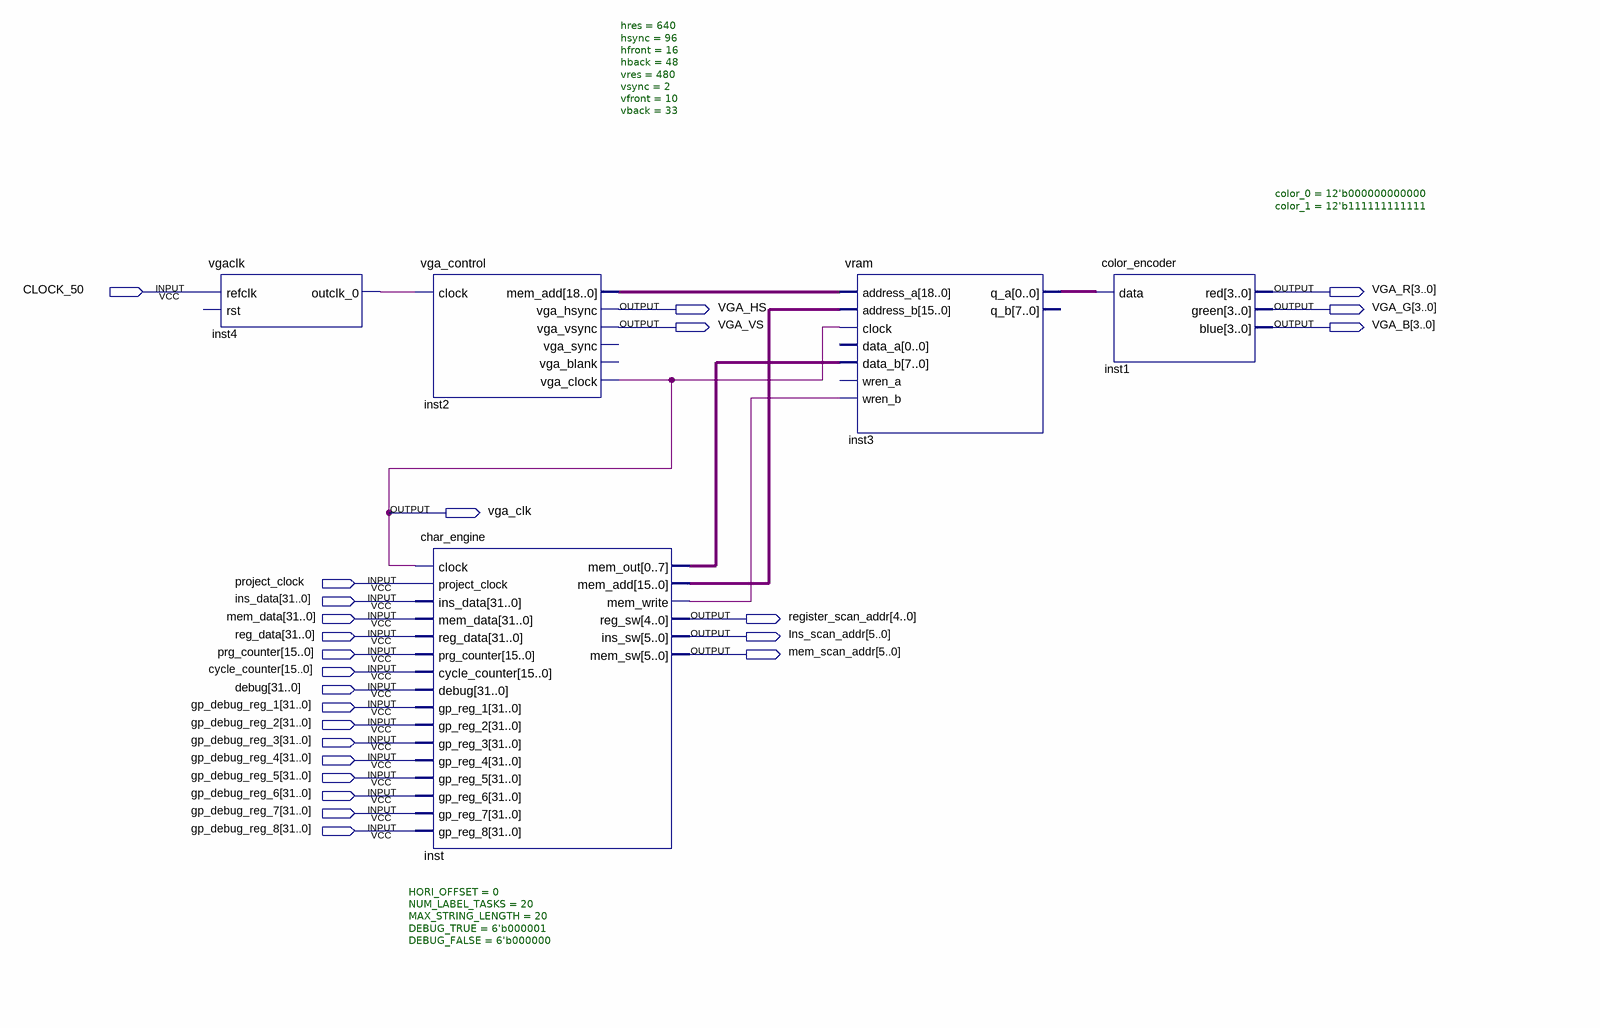
[diagram p0: schematic sheet]
// Quartus schematic VGA_BLOCK.bdf as structural Verilog: 5 symbols, 25 pins
module VGA_BLOCK (
  input  CLOCK_50,
  input  project_clock,
  input  [31:0] ins_data,
  input  [31:0] mem_data,
  input  [31:0] reg_data,
  input  [15:0] prg_counter,
  input  [15:0] cycle_counter,
  input  [31:0] debug,
  input  [31:0] gp_debug_reg_1,
  input  [31:0] gp_debug_reg_2,
  input  [31:0] gp_debug_reg_3,
  input  [31:0] gp_debug_reg_4,
  input  [31:0] gp_debug_reg_5,
  input  [31:0] gp_debug_reg_6,
  input  [31:0] gp_debug_reg_7,
  input  [31:0] gp_debug_reg_8,
  output [3:0] VGA_R,
  output VGA_HS,
  output [3:0] VGA_G,
  output VGA_VS,
  output [3:0] VGA_B,
  output vga_clk,
  output [4:0] register_scan_addr,
  output [5:0] Ins_scan_addr,
  output [5:0] mem_scan_addr
);

  wire inst3_q_a, inst4_outclk_0, inst_mem_write;
  wire [7:0] inst_mem_out;
  wire [15:0] inst_mem_add;
  wire [18:0] inst2_mem_add;

  vgaclk inst4 (.refclk(CLOCK_50), .outclk_0(inst4_outclk_0));  // open: rst
  vga_control #(.hres(640), .hsync(96), .hfront(16), .hback(48), .vres(480), .vsync(2), .vfront(10), .vback(33)) inst2 (
    .clock(inst4_outclk_0), .mem_add(inst2_mem_add), .vga_hsync(VGA_HS), .vga_vsync(VGA_VS),
    .vga_clock(vga_clk));  // open: vga_sync, vga_blank
  char_engine #(.HORI_OFFSET(0), .NUM_LABEL_TASKS(20), .MAX_STRING_LENGTH(20), .DEBUG_TRUE(6'b000001), .DEBUG_FALSE(6'b000000)) inst (
    .clock(vga_clk), .project_clock(project_clock), .ins_data(ins_data), .mem_data(mem_data),
    .reg_data(reg_data), .prg_counter(prg_counter), .cycle_counter(cycle_counter), .debug(debug),
    .gp_reg_1(gp_debug_reg_1), .gp_reg_2(gp_debug_reg_2), .gp_reg_3(gp_debug_reg_3),
    .gp_reg_4(gp_debug_reg_4), .gp_reg_5(gp_debug_reg_5), .gp_reg_6(gp_debug_reg_6),
    .gp_reg_7(gp_debug_reg_7), .gp_reg_8(gp_debug_reg_8), .mem_out(inst_mem_out), .mem_add(inst_mem_add),
    .mem_write(inst_mem_write), .reg_sw(register_scan_addr), .ins_sw(Ins_scan_addr), .mem_sw(mem_scan_addr));
  vram inst3 (
    .address_a(inst2_mem_add), .address_b(inst_mem_add), .clock(vga_clk), .data_b(inst_mem_out),
    .wren_b(inst_mem_write), .q_a(inst3_q_a));  // open: data_a, wren_a, q_b
  color_encoder #(.color_0(12'b000000000000), .color_1(12'b111111111111)) inst1 (
    .data(inst3_q_a), .red(VGA_R), .green(VGA_G), .blue(VGA_B));
endmodule
